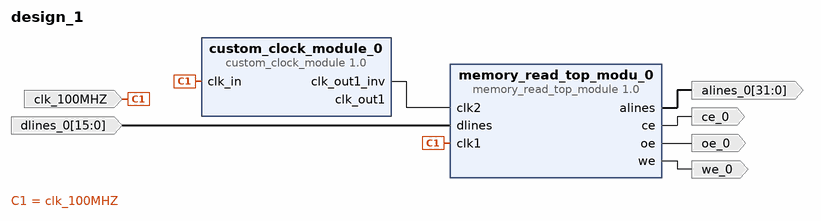
[diagram p0: block diagram of the top level]
# Vivado block design design_1, xc7z020clg400-1, Vivado 2022.1
create_bd_design design_1

create_bd_port -dir I -type clk clk_100MHZ
create_bd_port -dir O -from 31 -to 0 alines_0
create_bd_port -dir O ce_0
create_bd_port -dir O oe_0
create_bd_port -dir O we_0
create_bd_port -dir I -from 15 -to 0 dlines_0

create_bd_cell -type ip -vlnv seceng.fim.uni-passau.de:custom_clock_module:custom_clock_module:1.0 custom_clock_module_0
create_bd_cell -type ip -vlnv seceng.fim.uni-passau.de:seceng.fim.uni-passau.de:memory_read_top_module:1.0 memory_read_top_modu_0

# ---- connections ----

connect_bd_net [get_bd_ports clk_100MHZ] [get_bd_pins custom_clock_module_0/clk_in] [get_bd_pins memory_read_top_modu_0/clk1]
# net custom_clock_module_0_clk_out1 has one end: custom_clock_module_0/clk_out1
connect_bd_net [get_bd_pins custom_clock_module_0/clk_out1_inv] [get_bd_pins memory_read_top_modu_0/clk2]
connect_bd_net -net dlines_0_1 [get_bd_ports dlines_0] [get_bd_pins memory_read_top_modu_0/dlines]
connect_bd_net [get_bd_pins memory_read_top_modu_0/alines] [get_bd_ports alines_0]
connect_bd_net [get_bd_pins memory_read_top_modu_0/ce] [get_bd_ports ce_0]
connect_bd_net [get_bd_pins memory_read_top_modu_0/oe] [get_bd_ports oe_0]
connect_bd_net [get_bd_pins memory_read_top_modu_0/we] [get_bd_ports we_0]

validate_bd_design
save_bd_design
